# EAGLE schematic ECE3992_APS (EAGLE 9.6.2)
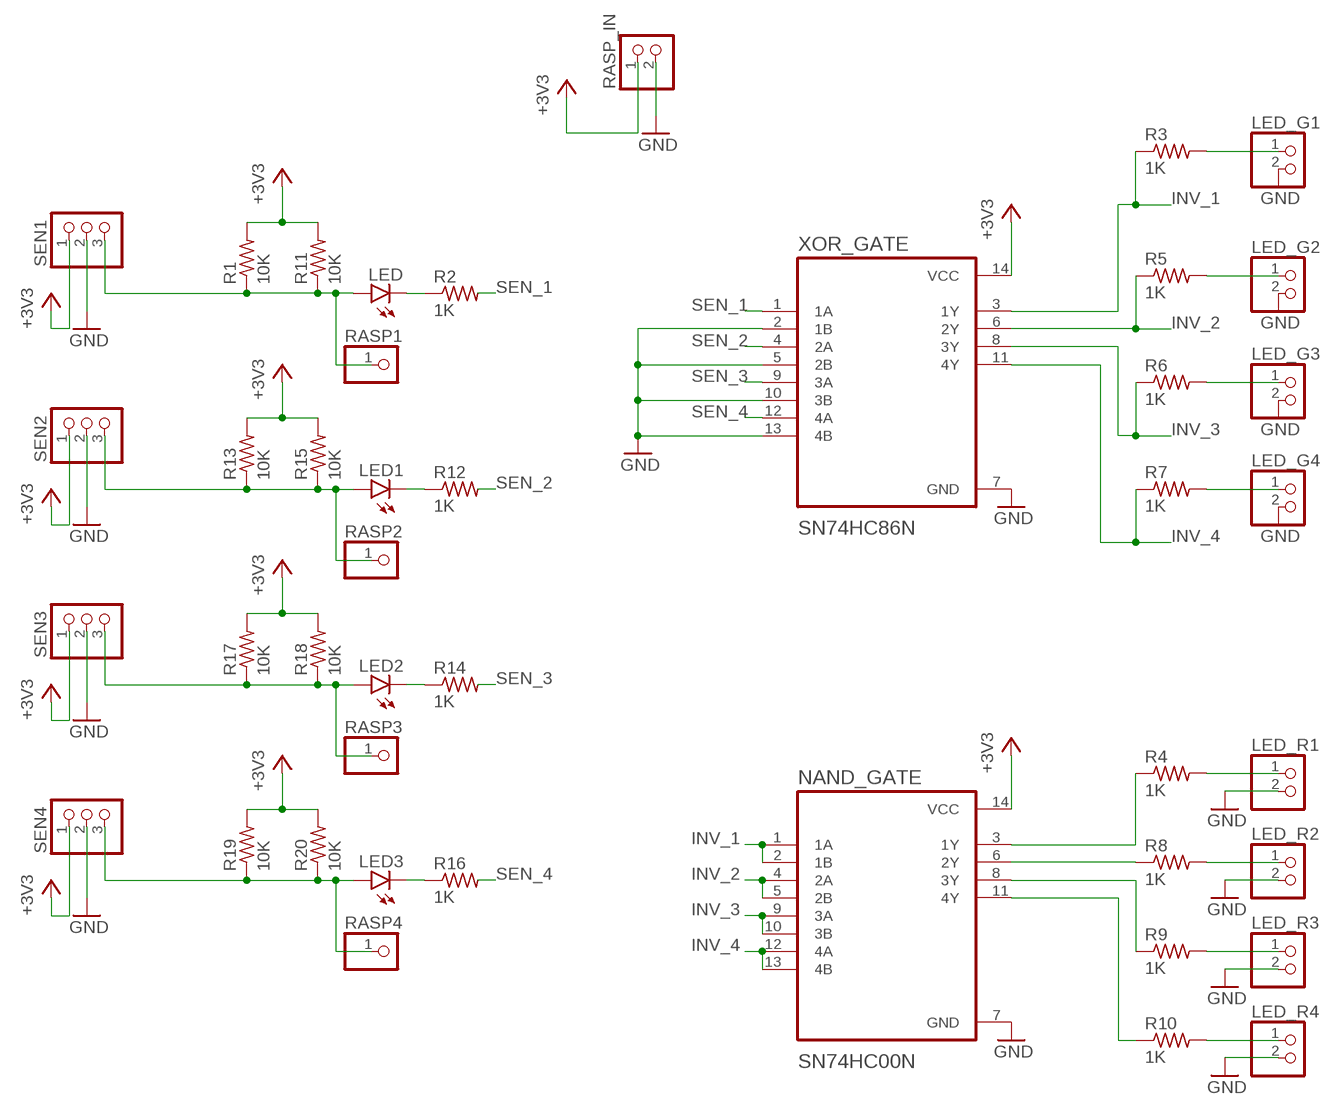
[diagram p0: schematic, sheet 1]

## Parts
LED  LED5MM  [LED5MM]
LED1  LED5MM  [LED5MM]
LED2  LED5MM  [LED5MM]
LED3  LED5MM  [LED5MM]
LED_G1  PINHD-1X2  [1X02]
LED_G2  PINHD-1X2  [1X02]
LED_G3  PINHD-1X2  [1X02]
LED_G4  PINHD-1X2  [1X02]
LED_R1  PINHD-1X2  [1X02]
LED_R2  PINHD-1X2  [1X02]
LED_R3  PINHD-1X2  [1X02]
LED_R4  PINHD-1X2  [1X02]
NAND_GATE  SN74HC00N  [DIP794W45P254L1969H508Q14]
R1  10K  R-US_0207/10  [0207/10]
R2  1K  R-US_0207/10  [0207/10]
R3  1K  R-US_0207/10  [0207/10]
R4  1K  R-US_0207/10  [0207/10]
R5  1K  R-US_0207/10  [0207/10]
R6  1K  R-US_0207/10  [0207/10]
R7  1K  R-US_0207/10  [0207/10]
R8  1K  R-US_0207/10  [0207/10]
R9  1K  R-US_0207/10  [0207/10]
R10  1K  R-US_0207/10  [0207/10]
R11  10K  R-US_0207/10  [0207/10]
R12  1K  R-US_0207/10  [0207/10]
R13  10K  R-US_0207/10  [0207/10]
R14  1K  R-US_0207/10  [0207/10]
R15  10K  R-US_0207/10  [0207/10]
R16  1K  R-US_0207/10  [0207/10]
R17  10K  R-US_0207/10  [0207/10]
R18  10K  R-US_0207/10  [0207/10]
R19  10K  R-US_0207/10  [0207/10]
R20  10K  R-US_0207/10  [0207/10]
RASP1  PINHD-1X1  [1X01]
RASP2  PINHD-1X1  [1X01]
RASP3  PINHD-1X1  [1X01]
RASP4  PINHD-1X1  [1X01]
RASP_IN  PINHD-1X2  [1X02]
SEN1  PINHD-1X3  [1X03]
SEN2  PINHD-1X3  [1X03]
SEN3  PINHD-1X3  [1X03]
SEN4  PINHD-1X3  [1X03]
XOR_GATE  SN74HC86N  [DIP794W45P254L1969H508Q14]

## Nets
+3V3: NAND_GATE.14(VCC) R1.2 R11.2 R13.2 R15.2 R17.2 R18.2 R19.2 R20.2 RASP_IN.1 SEN1.1 SEN2.1 SEN3.1 SEN4.1 XOR_GATE.14(VCC)
GND: LED_G1.2 LED_G2.2 LED_G3.2 LED_G4.2 LED_R1.2 LED_R2.2 LED_R3.2 LED_R4.2 NAND_GATE.7(GND) RASP_IN.2 SEN1.2 SEN2.2 SEN3.2 SEN4.2 XOR_GATE.2(1B) XOR_GATE.5(2B) XOR_GATE.7(GND) XOR_GATE.10(3B) XOR_GATE.13(4B)
INV_1: NAND_GATE.1(1A) NAND_GATE.2(1B) R3.1 XOR_GATE.3(1Y)
INV_2: NAND_GATE.4(2A) NAND_GATE.5(2B) R5.1 XOR_GATE.6(2Y)
INV_3: NAND_GATE.9(3A) NAND_GATE.10(3B) R6.1 XOR_GATE.8(3Y)
INV_4: NAND_GATE.12(4A) NAND_GATE.13(4B) R7.1 XOR_GATE.11(4Y)
N$1: LED.A R1.1 R11.1 RASP1.1 SEN1.3
N$2: LED.K(C) R2.1
N$3: LED_G1.1 R3.2
N$4: LED_G2.1 R5.2
N$5: LED_G3.1 R6.2
N$6: LED_G4.1 R7.2
N$7: LED_R1.1 R4.2
N$8: LED_R2.1 R8.2
N$9: LED_R3.1 R9.2
N$10: LED_R4.1 R10.2
N$11: NAND_GATE.6(2Y) R8.1
N$12: NAND_GATE.3(1Y) R4.1
N$13: LED1.K(C) R12.1
N$14: LED1.A R13.1 R15.1 RASP2.1 SEN2.3
N$15: LED2.K(C) R14.1
N$16: LED3.K(C) R16.1
N$17: LED3.A R19.1 R20.1 RASP4.1 SEN4.3
N$18: LED2.A R17.1 R18.1 RASP3.1 SEN3.3
N$19: NAND_GATE.8(3Y) R9.1
N$20: NAND_GATE.11(4Y) R10.1
SEN_1: R2.2 XOR_GATE.1(1A)
SEN_2: R12.2 XOR_GATE.4(2A)
SEN_3: R14.2 XOR_GATE.9(3A)
SEN_4: R16.2 XOR_GATE.12(4A)

## Library data of the parts
LED LED1-LED3 = led:LED: LED OSRAM: - CHIPLED LG R971, LG N971, LY N971, LG Q971, LY Q971, LO R971, LY R971 LH N974, LH R974 LS Q976, LO Q976, LY Q976 LO Q996 - Hyper CHIPLED LW Q18S LB Q993, LB Q99A, LB R99A - SideLED LS A670, LO A670, LY A670, LG A670, LP A670 LB A673, LV A673, LT A673, LW A673 LH A674 LY A675 LS A676, LA A676, LO A676, LY A676, LW A676 LS A679, LY A679, LG A679 - Hyper Micro SIDELED® LS Y876, LA Y876, LO Y876, LY Y876 LT Y87S - SmartLED LW L88C, LW L88S LB L89C, LB L89S, LG L890 LS L89K, LO L89K, LY L89K LS L896, LA L896, LO L896, LY L896 - TOPLED LS T670, LO T670, LY T670, LG T670, LP T670 LSG T670, LSP T670, LSY T670, LOP T670, LYG T670 LG T671, LOG T671, LSG T671 LB T673, LV T673, LT T673, LW T673 LH T674 LS T676, LA T676, LO T676, LY T676, LB T676, LH T676, LSB T676, LW T676 LB T67C, LV T67C, LT T67C, LS T67K, LO T67K, LY T67K, LW E67C LS E67B, LA E67B, LO E67B, LY E67B, LB E67C, LV E67C, LT E67C LW T67C LS T679, LY T679, LG T679 LS T770, LO T770, LY T770, LG T770, LP T770 LB T773, LV T773, LT T773, LW T773 LH T774 LS E675, LA E675, LY E675, LS T675 LS T776, LA T776, LO T776, LY T776, LB T776 LHGB T686 LT T68C, LB T68C - Hyper Mini TOPLED® LB M676 - Mini TOPLED Santana® LG M470 LS M47K, LO M47K, LY M47K Source: http://www.osram.convergy.de LUXEON: - LUMILED® LXK2-PW12-R00, LXK2-PW12-S00, LXK2-PW14-U00, LXK2-PW14-V00 LXK2-PM12-R00, LXK2-PM12-S00, LXK2-PM14-U00 LXK2-PE12-Q00, LXK2-PE12-R00, LXK2-PE12-S00, LXK2-PE14-T00, LXK2-PE14-U00 LXK2-PB12-K00, LXK2-PB12-L00, LXK2-PB12-M00, LXK2-PB14-N00, LXK2-PB14-P00, LXK2-PB14-Q00 LXK2-PR12-L00, LXK2-PR12-M00, LXK2-PR14-Q00, LXK2-PR14-R00 LXK2-PD12-Q00, LXK2-PD12-R00, LXK2-PD12-S00 LXK2-PH12-R00, LXK2-PH12-S00 LXK2-PL12-P00, LXK2-PL12-Q00, LXK2-PL12-R00 Source: www.luxeon.com KINGBRIGHT: KA-3528ASYC Source: www.kingbright.com
LED_G1-LED_G4 LED_R1-LED_R4 RASP_IN = pinhead:PINHD-1X2: PIN HEADER
NAND_GATE = SN74HC00N:SN74HC00N: Check availability <https://pricing.snapeda.com/parts/SN74HC00N/Texas%20Instruments/view-part?ref=eda>; AVAILABILITY: In Stock; CHECK_PRICES: https://www.snapeda.com/parts/SN74HC00N/Texas+Instruments/view-part/?ref=eda; DESCRIPTION: 4-ch, 2-input, 2-V to 6-V 5.2 mA drive strength NAND gate; MF: Texas Instruments; MP: SN74HC00N; PACKAGE: PDIP-14 Texas Instruments; PRICE: None; SNAPEDA_LINK: https://www.snapeda.com/parts/SN74HC00N/Texas+Instruments/view-part/?ref=snap
R1-R20 = rcl:R-US_: RESISTOR, American symbol; SPICEPREFIX: R
RASP1-RASP4 = pinhead:PINHD-1X1: PIN HEADER
SEN1-SEN4 = pinhead:PINHD-1X3: PIN HEADER
XOR_GATE = SN74HC86N:SN74HC86N: Check availability <https://pricing.snapeda.com/parts/SN74HC86N/Texas%20Instruments/view-part?ref=eda>; AVAILABILITY: In Stock; CHECK_PRICES: https://www.snapeda.com/parts/SN74HC86N/Texas+Instruments/view-part/?ref=eda; DESCRIPTION: 4-ch, 2-input, 2-V to 6-V 5.2 mA drive strength XOR (exclusive OR) gate; MF: Texas Instruments; MP: SN74HC86N; PACKAGE: PDIP-14 Texas Instruments; PRICE: None; PURCHASE-URL: https://www.snapeda.com/api/url_track_click_mouser/?unipart_id=236147&manufacturer=Texas Instruments&part_name=SN74HC86N&search_term= sn74hc86n; SNAPEDA_LINK: https://www.snapeda.com/parts/SN74HC86N/Texas+Instruments/view-part/?ref=snap